# Altium project AMC_FMC_Carrier v3.PrjPcb (part 10 of 15)

## Sheet IPMI.SchDoc
size A4; DocumentNumber: 5; SheetNumber: 5; SheetTotal: 30
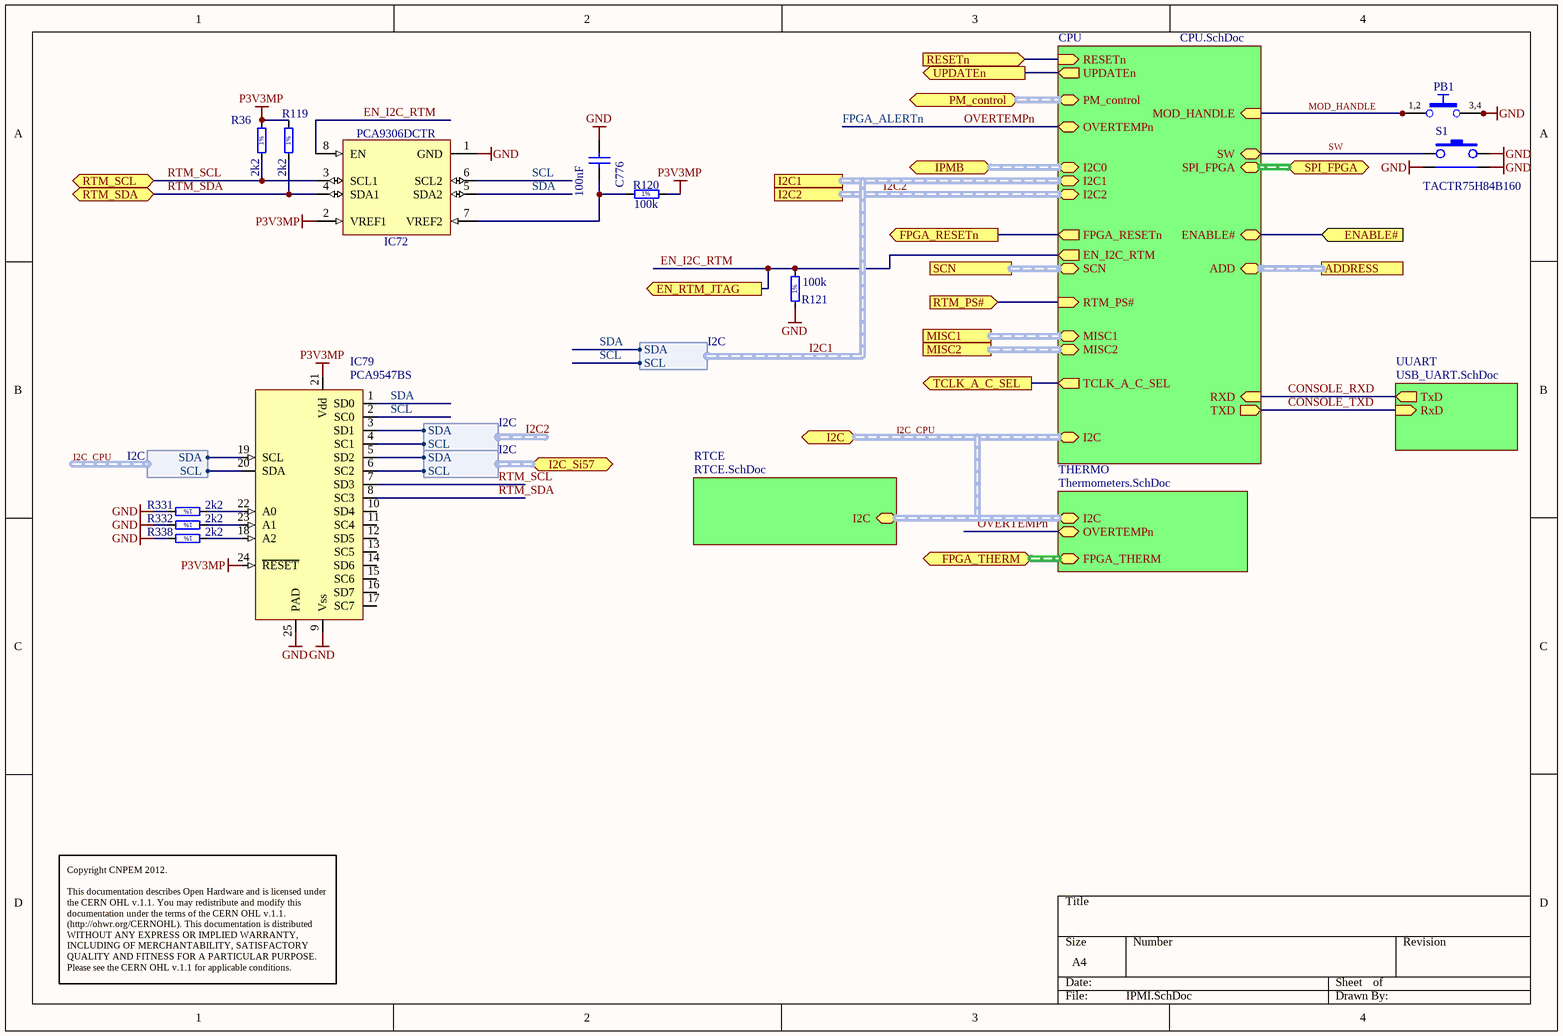
[diagram p20: IPMI.SchDoc]

### Parts
C776  100nF  [CAPC0603X33N]
IC72  PCA9306DCTR  [SOP65P400X130-8N]
IC79  PCA9547BS  [HVQFN24]
PB1  Push Button  [SW_C&K_HDT0001]  (value not drawn)
R36  2k2  [RESC1005X40N]
R119  2k2  [RESC1005X40N]
R120  100k  [RESC1005X40N]
R121  100k  [RESC1005X40N]
R331  2k2  [RESC1005X40N]
R332  2k2  [RESC1005X40N]
R338  2k2  [RESC1005X40N]
S1  TACTR75H84B160  [PB_ALPS_SKHHLQA010]

### Sub-sheets
CPU = CPU.SchDoc: ENABLE#, PM_control (harness PM_control), OVERTEMPn (bidir), MOD_HANDLE (in), SPI_FPGA (harness SPI), SW, RXD (in), TXD (out), RESETn (in), UPDATEn (out), I2C (harness I2C), I2C0 (harness I2C), I2C1 (harness I2C), I2C2 (harness I2C), MISC1 (harness MISC), MISC2 (harness MISC), ADD (harness AMC_ADD), SCN (harness SCN), FPGA_RESETn (out), RTM_PS# (in), EN_I2C_RTM (out), TCLK_A_C_SEL (out)
RTCE = RTCE.SchDoc: I2C (harness I2C)
THERMO = Thermometers.SchDoc: OVERTEMPn (bidir), FPGA_THERM (harness FPGA_THERM), I2C (harness I2C)
UUART = USB_UART.SchDoc: TxD (out), RxD (in)

### Ports
ADDRESS (harness AMC_ADD), EN_RTM_JTAG (out), ENABLE# (in), FPGA_RESETn (out), FPGA_THERM (harness FPGA_THERM), I2C1 (harness I2C), I2C2 (harness I2C), I2C (harness I2C), I2C_Si57 (harness I2C), IPMB (harness I2C), MISC1 (harness MISC), MISC2 (harness MISC), PM_control (harness PM_control), RESETn (in), RTM_PS# (in), RTM_SCL (bidir), RTM_SDA (bidir), SCN (harness SCN), SPI_FPGA (harness SPI), TCLK_A_C_SEL (out), UPDATEn (out)

### Harnesses
I2C: SCL, SDA

### Nets
GND: C776.2 IC72.1(GND) IC79.9(Vss) IC79.25(PAD) PB1.3 PB1.4 R121.1 R331.2 R332.2 R338.2 S1.2 S1.3 S1.4
P3V3MP: IC72.2(VREF1) IC79.21(Vdd) IC79.24(~{RESET}) R36.2 R119.2 R120.2
CONSOLE_RXD: sheet CPU/RXD, sheet UUART/TxD
CONSOLE_TXD: sheet CPU/TXD, sheet UUART/RxD
EN_I2C_RTM: IC72.8(EN) R121.2 ; port EN_RTM_JTAG, sheet CPU/EN_I2C_RTM
FPGA_ALERTn: sheet CPU/OVERTEMPn, sheet THERMO/OVERTEMPn  [also labelled OVERTEMPn]
FPGA_RESETn: port FPGA_RESETn, sheet CPU/FPGA_RESETn
I2C2.SCL: IC79.4(SC1) ; port I2C2.SCL
I2C2.SDA: IC79.3(SD1) ; port I2C2.SDA
I2C_CPU.SCL: IC79.20(SDA) ; port I2C.SCL
I2C_CPU.SDA: IC79.19(SCL) ; port I2C.SDA
I2C_Si57.SCL: IC79.6(SC2) ; port I2C_Si57.SCL
I2C_Si57.SDA: IC79.5(SD2) ; port I2C_Si57.SDA
MOD_HANDLE: PB1.1 PB1.2 ; sheet CPU/MOD_HANDLE
RESETn: port RESETn, sheet CPU/RESETn
RTM_PS#: port RTM_PS#, sheet CPU/RTM_PS#
RTM_SCL: IC72.3(SCL1) IC79.7(SD3) R36.1 ; port RTM_SCL
RTM_SDA: IC72.4(SDA1) IC79.8(SC3) R119.1 ; port RTM_SDA
SCL: IC72.6(SCL2) IC79.2(SC0) ; port I2C1.SCL  [project net I2C1.SCL]
SCN_ENn: port ENABLE#, sheet CPU/ENABLE#
SDA: IC72.5(SDA2) IC79.1(SD0) ; port I2C1.SDA  [project net I2C1.SDA]
SW: S1.1 ; sheet CPU/SW
TCLK_A_C_SEL: port TCLK_A_C_SEL, sheet CPU/TCLK_A_C_SEL
UPDATEn: port UPDATEn, sheet CPU/UPDATEn
NetC776_1: C776.1 IC72.7(VREF2) R120.1
NetIC79_18: IC79.18(A2) R338.1
NetIC79_22: IC79.22(A0) R331.1
NetIC79_23: IC79.23(A1) R332.1

Not connected (* = marked no-connect by the designer): IC79 10(SD4) 11(SC4) 12(SD5) 13(SC5) 14(SD6) 15(SC6) 16(SD7) 17(SC7)

### Buses and harness runs
harness I2C1 = port I2C1 = sheet CPU/I2C1
harness I2C2 = port I2C2 = sheet CPU/I2C2
harness I2C_CPU = port I2C = sheet CPU/I2C = sheet RTCE/I2C = sheet THERMO/I2C
harness port ADDRESS = sheet CPU/ADD
harness port FPGA_THERM = sheet THERMO/FPGA_THERM
harness port IPMB = sheet CPU/I2C0
harness port MISC1 = sheet CPU/MISC1
harness port MISC2 = sheet CPU/MISC2
harness port PM_control = sheet CPU/PM_control
harness port SCN = sheet CPU/SCN
harness port SPI_FPGA = sheet CPU/SPI_FPGA

### Notes on the sheet
- Copyright CNPEM 2012.
  This documentation describes Open Hardware and is licensed under the CERN OHL v.1.1. You may redistribute and modify this documentation under the terms of the CERN OHL v.1.1. (http://ohwr.org/CERNOHL). This documentation is distributed WITHOUT ANY EXPRESS OR IMPLIED WARRANTY, INCLUDING OF MERCHANTABILITY, SATISFACTORY QUALITY AND FITNESS FOR A PARTICULAR PURPOSE. Please see the CERN OHL v.1.1 for applicable conditions.
- (in symbol R0402_2K2_1%_0.0625W_100PPM) 1%
- (in symbol R0402_100K_1%_0.0625W_100PPM) 1%
- (in symbol SW_C&K_HDT0001) 1,2; 3,4

### Library data of the parts
C776 = CC0201_100NF_6.3V_10%_X5R: Non-polarised capacitor; Part Description: SMD Multilayer Chip Ceramic Capacitor; Manufacturer: GENERIC; Manufacturer1 Part Number: 02016D104KAT2A; Voltage: 6.3V; TC: X5R; Tolerance: ±10%; Table: Capacitors SMD; Part Number: CC0201_100NF_6.3V_10%_X5R; Component Kind: Standard; Component Type: Standard; Pin Count: 2; Value: 100nF; Status: Not Recommended; Manufacturer Part Number: CC0201_100NF_6.3V_10%_X5R; Case: 0201; Mounted: Yes; Socket: No; SMD: Yes; Manufacturer1 Example: AVX; Manufacturer1 ComponentHeight: 0.33mm; HelpURL: \\cern.ch\dfs\Applications\Altium\Datasheets\CC0201_X5R_AVX.pdf; Author: CERN DEM JLC; CreateDate: 2007-12-03; LatestRevisionDate: 2007-12-03
IC72 = PCA9306DCTR: Dual Bidirectional I2C Bus And SMBus Voltage-Level Translator; Manufacturer: TEXAS INSTRUMENTS; Table: Analog & Interface; Part Number: PCA9306DCTR; Component Kind: Standard; Component Type: Standard; Device: PCA9306DCTR; PackageDescription: SOP, 0.65mm, Pitch; 8 Pin, 2.80mm W X 2.95mm L X 1.30mm H Body, PC Medium Density; Part Description: Dual Bidirectional I2C Bus And SMBus Voltage-Level Translator; Manufacturer Part Number: PCA9306DCTR; Pin Count: 8; Case: SSOP8; Mounted: Yes; Socket: No; SMD: Yes; ComponentHeight: 1.3mm; Author: CERN DEM JLC; HelpURL: \\cern.ch\dfs\Applications\Altium\Datasheets\PCA9306DCTR.pdf; CreateDate: 2013-02-25; LatestRevisionDate: 2013-02-25
IC79 = IIC_MUX_PCA9547: 8-channel I2C-bus multiplexer with reset
PB1 = SW_C&K_HDT0001: Push-Button Switch SPDT; Part Description: 5VDC 1mA SPST-NO Micro Mini Surface Surface Mount Detect Push-Button Switch, HDT Serie; Manufacturer: C&K; Table: Switches; Part Number: SW_C&K_HDT0001; Component Kind: Standard; Component Type: Standard; Pin Count: 4; PackageDescription: Body 3.5x2.8mm, Micro Mini Surface Mount Detect Switches, HDT Serie; Family: Push Button; Mounted: Yes; Socket: No; SMD: Yes; Status: None; Manufacturer Part Number: HDT0001; ComponentHeight: 3.35mm; HelpURL: \\cern.ch\dfs\Applications\Altium\Datasheets\SW_C&K_HDT0001.pdf; Author: CERN DEM JLC; CreateDate: 2012-08-15; LatestRevisionDate: 2012-08-15
R36 R119 R331 R332 R338 = R0402_2K2_1%_0.0625W_100PPM: Resistor - 1%; Part Description: General Purpose Thick Film Chip Resistor; Manufacturer: GENERIC; Manufacturer1 Part Number: 232270672202L; TC: ±100ppm/°C; Table: Resistors SMD; Part Number: R0402_2K2_1%_0.0625W_100PPM; Component Kind: Standard; Component Type: Standard; Pin Count: 2; Value: 2k2; Status: Not recommended; Power: 0.0625W; Tolerance: ±1%; Manufacturer Part Number: R0402_2K2_1%_0.0625W_100PPM; Case: 0402; Mounted: Yes; Socket: No; SMD: Yes; Manufacturer1 Example: YAGEO PHYCOMP; Manufacturer1 ComponentHeight: 0.4mm; HelpURL: \\cern.ch\dfs\Applications\Altium\Datasheets\R0402_Phycomp_RC0402.pdf; Author: CERN DEM JLC; CreateDate: 2007-12-03; LatestRevisionDate: 2012-10-17
R120 R121 = R0402_100K_1%_0.0625W_100PPM: Resistor - 1%; Part Description: General Purpose Thick Film Chip Resistor; Manufacturer: GENERIC; Manufacturer1 Part Number: 232270671004L; TC: ±100ppm/°C; Table: Resistors SMD; Part Number: R0402_100K_1%_0.0625W_100PPM; Component Kind: Standard; Component Type: Standard; Pin Count: 2; Value: 100k; Status: Not recommended; Power: 0.0625W; Tolerance: ±1%; Manufacturer Part Number: R0402_100K_1%_0.0625W_100PPM; Case: 0402; Mounted: Yes; Socket: No; SMD: Yes; Manufacturer1 Example: YAGEO PHYCOMP; Manufacturer1 ComponentHeight: 0.4mm; HelpURL: \\cern.ch\dfs\Applications\Altium\Datasheets\R0402_Phycomp_RC0402.pdf; Author: CERN DEM JLC; CreateDate: 2007-12-03; LatestRevisionDate: 2012-10-17
S1 = SW-PB_RA_5.8mm: Push button

## Sheet CPU.SchDoc
size A3; DocumentNumber: 11; SheetNumber: 11; SheetTotal: 30
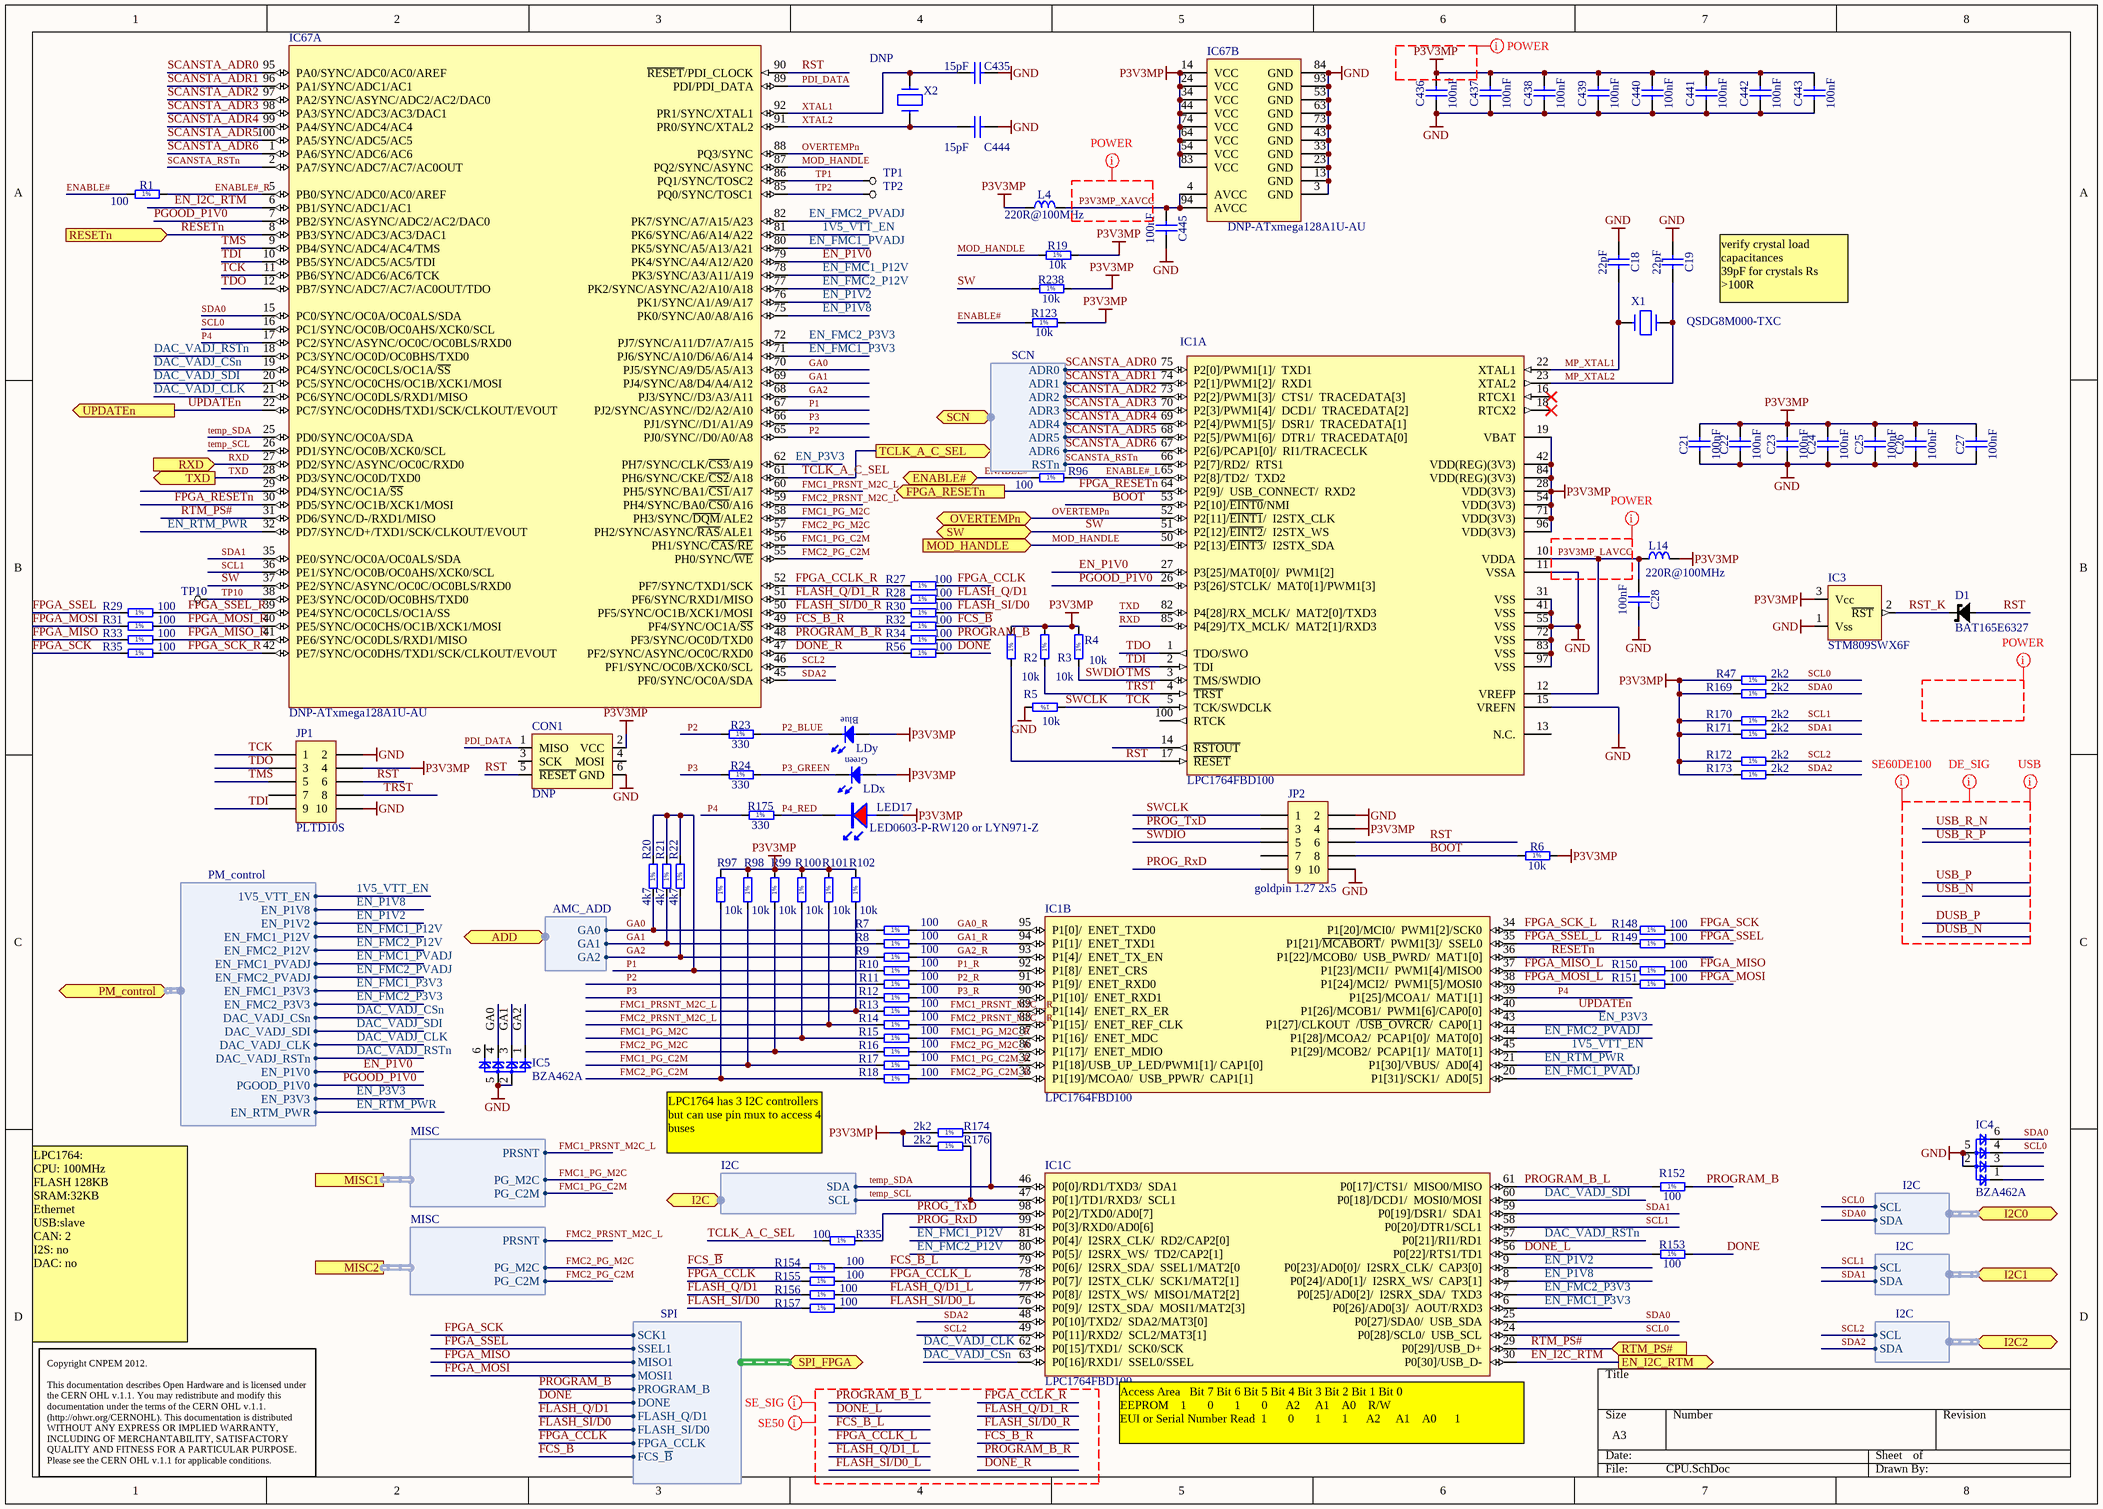
[diagram p21: CPU.SchDoc]

### Parts
C18  22pF  [CAPC1005X55N]
C19  22pF  [CAPC1005X55N]
C21  100nF  [CAPC0603X33N]
C22  100nF  [CAPC0603X33N]
C23  100nF  [CAPC0603X33N]
C24  100nF  [CAPC0603X33N]
C25  100nF  [CAPC0603X33N]
C26  100nF  [CAPC0603X33N]
C27  100nF  [CAPC0603X33N]
C28  100nF  [CAPC0603X33N]
C435  15pF  [CAPC1005X55N]
C436  100nF  [CAPC0603X33N]
C437  100nF  [CAPC0603X33N]
C438  100nF  [CAPC0603X33N]
C439  100nF  [CAPC0603X33N]
C440  100nF  [CAPC0603X33N]
C441  100nF  [CAPC0603X33N]
C442  100nF  [CAPC0603X33N]
C443  100nF  [CAPC0603X33N]
C444  15pF  [CAPC1005X55N]
C445  100nF  [CAPC0603X33N]
CON1  DNP  [PLTD6S]
D1  BAT165E6327  [SOD323]
IC1  LPC1764FBD100  [LQFP100-LPC]  (parts A,B,C of 3)
IC3  STM809SWX6F  [SOT-23]
IC4  BZA462A  [SOT23-6]
IC5  BZA462A  [SOT23-6]
IC67  DNP-ATxmega128A1U-AU  [TQFP100]  (parts A,B of 2)
JP1  PLTD10S  [PLTD10S]
JP2  goldpin 1.27 2x5  [CON_2x5_MINI]
L4  220R@100MHz  [INDC2012X105N]
L14  220R@100MHz  [INDC2012X105N]
LDx  Green  [LED_AVAGO_HSME-C120]  (value not drawn)
LDy  Blue  [LED_AVAGO_HSME-C120]  (value not drawn)
LED17  LED0603-P-RW120 or LYN971-Z  [led_0603R]
R1  100  [RESC1005X40N]
R2  10k  [RESC1005X40N]
R3  10k  [RESC1005X40N]
R4  10k  [RESC1005X40N]
R5  10k  [RESC1005X40N]
R6  10k  [RESC1005X40N]
R7  100  [RESC1005X40N]
R8  100  [RESC1005X40N]
R9  100  [RESC1005X40N]
R10  100  [RESC1005X40N]
R11  100  [RESC1005X40N]
R12  100  [RESC1005X40N]
R13  100  [RESC1005X40N]
R14  100  [RESC1005X40N]
R15  100  [RESC1005X40N]
R16  100  [RESC1005X40N]
R17  100  [RESC1005X40N]
R18  100  [RESC1005X40N]
R19  10k  [RESC1005X40N]
R20  4k7  [RESC1005X40N]
R21  4k7  [RESC1005X40N]
R22  4k7  [RESC1005X40N]
R23  330  [RESC1005X40N]
R24  330  [RESC1005X40N]
R27  100  [RESC1005X40N]
R28  100  [RESC1005X40N]
R29  100  [RESC1005X40N]
R30  100  [RESC1005X40N]
R31  100  [RESC1005X40N]
R32  100  [RESC1005X40N]
R33  100  [RESC1005X40N]
R34  100  [RESC1005X40N]
R35  100  [RESC1005X40N]
R47  2k2  [RESC1005X40N]
R56  100  [RESC1005X40N]
R96  100  [RESC1005X40N]
R97  10k  [RESC1005X40N]
R98  10k  [RESC1005X40N]
R99  10k  [RESC1005X40N]
R100  10k  [RESC1005X40N]
R101  10k  [RESC1005X40N]
R102  10k  [RESC1005X40N]
R123  10k  [RESC1005X40N]
R148  100  [RESC1005X40N]
R149  100  [RESC1005X40N]
R150  100  [RESC1005X40N]
R151  100  [RESC1005X40N]
R152  100  [RESC1005X40N]
R153  100  [RESC1005X40N]
R154  100  [RESC1005X40N]
R155  100  [RESC1005X40N]
R156  100  [RESC1005X40N]
R157  100  [RESC1005X40N]
R169  2k2  [RESC1005X40N]
R170  2k2  [RESC1005X40N]
R171  2k2  [RESC1005X40N]
R172  2k2  [RESC1005X40N]
R173  2k2  [RESC1005X40N]
R174  2k2  [RESC1005X40N]
R175  330  [RESC1005X40N]
R176  2k2  [RESC1005X40N]
R238  10k  [RESC1005X40N]
R335  100  [RESC1005X40N]
TP1  TP  [TP]  (value not drawn)
TP2  TP  [TP]  (value not drawn)
TP10  TP  [TP]  (value not drawn)
X1  QSDG8M000-TXC  [XTAL_5.0*3.2]
X2  DNP  [XTAL_5.0*3.2]

### Ports
ADD (harness AMC_ADD), EN_I2C_RTM (out), ENABLE#, FPGA_RESETn (out), I2C0 (harness I2C), I2C1 (harness I2C), I2C2 (harness I2C), I2C (harness I2C), MISC1 (harness MISC), MISC2 (harness MISC), MOD_HANDLE (in), OVERTEMPn (bidir), PM_control (harness PM_control), RESETn (in), RTM_PS# (in), RXD (in), SCN (harness SCN), SPI_FPGA (harness SPI), SW, TCLK_A_C_SEL (out), TXD (out), UPDATEn (out)

### Harnesses
SPI: SCK1, SSEL1, MISO1, MOSI1, FLASH_Q/D1, FLASH_SI/D0, PROGRAM_B, DONE, FPGA_CCLK, FCS_~{B}
PM_control: EN_P1V8, EN_P1V2, EN_FMC1_P12V, EN_FMC2_P12V, EN_FMC1_PVADJ, EN_FMC2_PVADJ, EN_FMC1_P3V3, EN_FMC2_P3V3, DAC_VADJ_CSn, DAC_VADJ_SDI, DAC_VADJ_CLK, DAC_VADJ_RSTn, 1V5_VTT_EN, EN_P1V0, PGOOD_P1V0, EN_P3V3, EN_RTM_PWR
I2C: SCL, SDA
MISC: PRSNT, PG_M2C, PG_C2M
AMC_ADD: GA0, GA1, GA2
SCN: ADR0, ADR1, ADR2, ADR3, ADR4, ADR5, ADR6, RSTn

### Nets
GND: C18.1 C19.1 C21.1 C22.1 C23.1 C24.1 C25.1 C26.1 C27.1 C28.2 C435.1 C436.1 C437.1 C438.1 C439.1 C440.1 C441.1 C442.1 C443.1 C444.1 C445.2 CON1.6(GND) IC1.11(VSSA) IC1.15(VREFN) IC1.31(VSS) IC1.41(VSS) IC1.55(VSS) IC1.72(VSS) IC1.83(VSS) IC1.97(VSS) IC3.1(Vss) IC4.2 IC4.5 IC5.2 IC5.5 IC67.3(GND) IC67.13(GND) IC67.23(GND) IC67.33(GND) IC67.43(GND) IC67.53(GND) IC67.63(GND) IC67.73(GND) IC67.84(GND) IC67.93(GND) JP1.2 JP1.10 JP2.2 JP2.10 R5.2
P3V3MP: C21.2 C22.2 C23.2 C24.2 C25.2 C26.2 C27.2 C436.2 C437.2 C438.2 C439.2 C440.2 C441.2 C442.2 C443.2 CON1.2(VCC) IC1.19(VBAT) IC1.28(VDD(3V3)) IC1.42(VDD(REG)(3V3)) IC1.54(VDD(3V3)) IC1.71(VDD(3V3)) IC1.84(VDD(REG)(3V3)) IC1.96(VDD(3V3)) IC3.3(Vcc) IC67.14(VCC) IC67.24(VCC) IC67.34(VCC) IC67.44(VCC) IC67.54(VCC) IC67.64(VCC) IC67.74(VCC) IC67.83(VCC) JP1.4 JP2.4 L4.1 L14.2 LDx.1(A) LDy.1(A) LED17.A R2.2 R3.2 R4.2 R6.2 R19.2 R47.1 R97.2 R98.2 R99.2 R100.2 R101.2 R102.2 R123.2 R169.1 R170.1 R171.1 R172.1 R173.1 R174.1 R176.1 R238.2
1V5_VTT_EN: IC1.45(P1[29]/MCOB2/__PCAP1[1]/__MAT0[1]) IC67.81(PK6/SYNC/A6/A14/A22) ; port PM_control.1V5_VTT_EN  [project net PM.1V5_VTT_EN]
BOOT: IC1.53(P2[10]/~{EINT0}/NMI) JP2.8 R6.1
DAC_VADJ_CLK: IC1.62(P0[15]/TXD1/__SCK0/SCK) IC67.21(PC6/SYNC/OC0DLS/RXD1/MISO) ; port PM_control.DAC_VADJ_CLK  [project net PM.DAC_VADJ_CLK]
DAC_VADJ_CSn: IC1.63(P0[16]/RXD1/__SSEL0/SSEL) IC67.19(PC4/SYNC/OC0CLS/OC1A/~{SS}) ; port PM_control.DAC_VADJ_CSn  [project net PM.DAC_VADJ_CSn]
DAC_VADJ_RSTn: IC1.57(P0[21]/RI1/RD1) IC67.18(PC3/SYNC/OC0D/OC0BHS/TXD0) ; port PM_control.DAC_VADJ_RSTn  [project net PM.DAC_VADJ_RSTn]
DAC_VADJ_SDI: IC1.60(P0[18]/DCD1/__MOSI0/MOSI) IC67.20(PC5/SYNC/OC0CHS/OC1B/XCK1/MOSI) ; port PM_control.DAC_VADJ_SDI  [project net PM.DAC_VADJ_SDI]
DONE: R56.2 R153.2 ; port SPI_FPGA.DONE  [project net FSPI.DONE]
DONE_L: IC1.56(P0[22]/RTS1/TD1) R153.1
DONE_R: IC67.47(PF2/SYNC/ASYNC/OC0C/RXD0) R56.1
EN_FMC1_P3V3: IC1.6(P0[26]/AD0[3]/__AOUT/RXD3) IC67.71(PJ6/SYNC/A10/D6/A6/A14) ; port PM_control.EN_FMC1_P3V3  [project net PM.EN_FMC1_P3V3]
EN_FMC1_P12V: IC1.81(P0[4]/__I2SRX_CLK/__RD2/CAP2[0]) IC67.78(PK3/SYNC/A3/A11/A19) ; port PM_control.EN_FMC1_P12V  [project net PM.EN_FMC1_P12V]
EN_FMC1_PVADJ: IC1.20(P1[31]/SCK1/__AD0[5]) IC67.80(PK5/SYNC/A5/A13/A21) ; port PM_control.EN_FMC1_PVADJ  [project net PM.EN_FMC1_PVADJ]
EN_FMC2_P3V3: IC1.7(P0[25]/AD0[2]/__I2SRX_SDA/__TXD3) IC67.72(PJ7/SYNC/A11/D7/A7/A15) ; port PM_control.EN_FMC2_P3V3  [project net PM.EN_FMC2_P3V3]
EN_FMC2_P12V: IC1.80(P0[5]/__I2SRX_WS/__TD2/CAP2[1]) IC67.77(PK2/SYNC/ASYNC/A2/A10/A18) ; port PM_control.EN_FMC2_P12V  [project net PM.EN_FMC2_P12V]
EN_FMC2_PVADJ: IC1.44(P1[28]/MCOA2/__PCAP1[0]/__MAT0[0]) IC67.82(PK7/SYNC/A7/A15/A23) ; port PM_control.EN_FMC2_PVADJ  [project net PM.EN_FMC2_PVADJ]
EN_I2C_RTM: IC1.30(P0[30]/USB_D-) IC67.6(PB1/SYNC/ADC1/AC1) ; port EN_I2C_RTM
EN_P1V0: IC1.27(P3[25]/MAT0[0]/__PWM1[2]) IC67.79(PK4/SYNC/A4/A12/A20) ; port PM_control.EN_P1V0  [project net PM.EN_P1V0]
EN_P1V2: IC1.9(P0[23]/AD0[0]/__I2SRX_CLK/__CAP3[0]) IC67.76(PK1/SYNC/A1/A9/A17) ; port PM_control.EN_P1V2  [project net PM.EN_P1V2]
EN_P1V8: IC1.8(P0[24]/AD0[1]/__I2SRX_WS/__CAP3[1]) IC67.75(PK0/SYNC/A0/A8/A16) ; port PM_control.EN_P1V8  [project net PM.EN_P1V8]
EN_P3V3: IC1.43(P1[27]/CLKOUT__/~{USB_OVRCR}/__CAP0[1]) IC67.62(PH7/SYNC/CLK/~{CS3}/A19) ; port PM_control.EN_P3V3  [project net PM.EN_P3V3]
EN_RTM_PWR: IC1.21(P1[30]/VBUS/__AD0[4]) IC67.32(PD7/SYNC/D+/TXD1/SCK/CLKOUT/EVOUT) ; port PM_control.EN_RTM_PWR  [project net PM.EN_RTM_PWR]
ENABLE#: R1.1 R96.1 R123.1 ; port ENABLE#  [project net SCN_ENn]
ENABLE#_L: IC1.65(P2[8]/TD2/__TXD2) R96.2
ENABLE#_R: IC67.5(PB0/SYNC/ADC0/AC0/AREF) R1.2
FCS_~{B}: R32.2 R154.1 ; port SPI_FPGA.FCS_~{B}  [project net FSPI.FCS_~{B}]
FCS_~{B}_L: IC1.79(P0[6]/__I2SRX_SDA/__SSEL1/MAT2[0) R154.2
FCS_~{B}_R: IC67.49(PF4/SYNC/OC1A/~{SS}) R32.1
FLASH_Q/D1: R28.2 R156.1 ; port SPI_FPGA.FLASH_Q/D1  [project net FSPI.FLASH_Q/D1]
FLASH_Q/D1_L: IC1.77(P0[8]/__I2STX_WS/__MISO1/MAT2[2]) R156.2
FLASH_Q/D1_R: IC67.51(PF6/SYNC/RXD1/MISO) R28.1
FLASH_SI/D0: R30.2 R157.1 ; port SPI_FPGA.FLASH_SI/D0  [project net FSPI.FLASH_SI/D0]
FLASH_SI/D0_L: IC1.76(P0[9]/__I2STX_SDA/__MOSI1/MAT2[3]) R157.2
FLASH_SI/D0_R: IC67.50(PF5/SYNC/OC1B/XCK1/MOSI) R30.1
FMC1_PG_C2M: IC67.56(PH1/SYNC/~{CAS}/~{RE}) R17.1 R98.1 ; port MISC1.PG_C2M  [project net MISC1.PG_C2M]
FMC1_PG_C2M_R: IC1.32(P1[18]/USB_UP_LED/PWM1[1]/_CAP1[0]) R17.2
FMC1_PG_M2C: IC67.58(PH3/SYNC/~{DQM}/ALE2) R15.1 R100.1 ; port MISC1.PG_M2C  [project net MISC1.PG_M2C]
FMC1_PG_M2C_R: IC1.87(P1[16]/__ENET_MDC) R15.2
FMC1_PRSNT_M2C__R: IC1.89(P1[14]/__ENET_RX_ER) R13.2
FMC1_PRSNT_M2C_L: IC67.60(PH5/SYNC/BA1/~{CS1}/A17) R13.1 R102.1 ; port MISC1.PRSNT  [project net MISC1.PRSNT]
FMC2_PG_C2M: IC67.55(PH0/SYNC/~{WE}) R18.1 R97.1 ; port MISC2.PG_C2M  [project net MISC2.PG_C2M]
FMC2_PG_C2M_R: IC1.33(P1[19]/MCOA0/__USB_PPWR/__CAP1[1]) R18.2
FMC2_PG_M2C: IC67.57(PH2/SYNC/ASYNC/~{RAS}/ALE1) R16.1 R99.1 ; port MISC2.PG_M2C  [project net MISC2.PG_M2C]
FMC2_PG_M2C_R: IC1.86(P1[17]/__ENET_MDIO) R16.2
FMC2_PRSNT_M2C__R: IC1.88(P1[15]/__ENET_REF_CLK) R14.2
FMC2_PRSNT_M2C_L: IC67.59(PH4/SYNC/BA0/~{CS0}/A16) R14.1 R101.1 ; port MISC2.PRSNT  [project net MISC2.PRSNT]
FPGA_CCLK: R27.2 R155.1 ; port SPI_FPGA.FPGA_CCLK  [project net FSPI.FPGA_CCLK]
FPGA_CCLK_L: IC1.78(P0[7]/__I2STX_CLK/__SCK1/MAT2[1]) R155.2
FPGA_CCLK_R: IC67.52(PF7/SYNC/TXD1/SCK) R27.1
FPGA_MISO: R33.1 R150.2 ; port SPI_FPGA.MISO1  [project net FSPI.MISO1]
FPGA_MISO_L: IC1.37(P1[23]/MCI1/__PWM1[4]/MISO0) R150.1
FPGA_MISO_R: IC67.41(PE6/SYNC/OC0DLS/RXD1/MISO) R33.2
FPGA_MOSI: R31.1 R151.2 ; port SPI_FPGA.MOSI1  [project net FSPI.MOSI1]
FPGA_MOSI_L: IC1.38(P1[24]/MCI2/__PWM1[5]/MOSI0) R151.1
FPGA_MOSI_R: IC67.40(PE5/SYNC/OC0CHS/OC1B/XCK1/MOSI) R31.2
FPGA_RESETn: IC1.64(P2[9]/__USB_CONNECT/__RXD2) IC67.30(PD5/SYNC/OC1B/XCK1/MOSI) ; port FPGA_RESETn
FPGA_SCK: R35.1 R148.2 ; port SPI_FPGA.SCK1  [project net FSPI.SCK1]
FPGA_SCK_L: IC1.34(P1[20]/MCI0/__PWM1[2]/SCK0) R148.1
FPGA_SCK_R: IC67.42(PE7/SYNC/OC0DHS/TXD1/SCK/CLKOUT/EVOUT) R35.2
FPGA_SSEL: R29.1 R149.2 ; port SPI_FPGA.SSEL1  [project net FSPI.SSEL1]
FPGA_SSEL_L: IC1.35(P1[21]/~{MCABORT}/__PWM1[3]/__SSEL0) R149.1
FPGA_SSEL_R: IC67.39(PE4/SYNC/OC0CLS/OC1A/SS) R29.2
GA0: IC5.4 IC67.70(PJ5/SYNC/A9/D5/A5/A13) R7.1 R20.1 ; port ADD.GA0  [project net ADD.GA0]
GA0_R: IC1.95(P1[0]/__ENET_TXD0) R7.2
GA1: IC5.3 IC67.69(PJ4/SYNC/A8/D4/A4/A12) R8.1 R21.1 ; port ADD.GA1  [project net ADD.GA1]
GA1_R: IC1.94(P1[1]/__ENET_TXD1) R8.2
GA2: IC5.1 IC67.68(PJ3/SYNC//D3/A3/A11) R9.1 R22.1 ; port ADD.GA2  [project net ADD.GA2]
GA2_R: IC1.93(P1[4]/__ENET_TX_EN) R9.2
MOD_HANDLE: IC1.50(P2[13]/~{EINT3}/__I2STX_SDA) IC67.87(PQ2/SYNC/ASYNC) R19.1 ; port MOD_HANDLE
MP_XTAL1: C18.2 IC1.22(XTAL1) X1.1
MP_XTAL2: C19.2 IC1.23(XTAL2) X1.2
OVERTEMPn: IC1.52(P2[11]/~{EINT1}/__I2STX_CLK) IC67.88(PQ3/SYNC) ; port OVERTEMPn  [project net FPGA_ALERTn]
P1: IC67.67(PJ2/SYNC/ASYNC//D2/A2/A10) R10.1 R20.2 R21.2 R22.2
P1_R: IC1.92(P1[8]/__ENET_CRS) R10.2
P2: IC67.65(PJ0/SYNC//D0/A0/A8) R11.1 R23.1
P2_BLUE: LDy.2(C) R23.2
P2_R: IC1.91(P1[9]/__ENET_RXD0) R11.2
P3: IC67.66(PJ1/SYNC//D1/A1/A9) R12.1 R24.1
P3_GREEN: LDx.2(C) R24.2
P3_R: IC1.90(P1[10]/__ENET_RXD1) R12.2
P3V3MP_LAVCC: C28.1 IC1.10(VDDA) IC1.12(VREFP) L14.1
P3V3MP_XAVCC: C445.1 IC67.4(AVCC) IC67.94(AVCC) L4.2
P4: IC1.39(P1[25]/MCOA1/__MAT1[1]) IC67.17(PC2/SYNC/ASYNC/OC0C/OC0BLS/RXD0) R175.1
P4_RED: LED17.K R175.2
PDI_DATA: CON1.1(MISO) IC67.89(PDI/PDI_DATA)
PGOOD_P1V0: IC1.26(P3[26]/STCLK/__MAT0[1]/PWM1[3]) IC67.7(PB2/SYNC/ASYNC/ADC2/AC2/DAC0) ; port PM_control.PGOOD_P1V0  [project net PM.PGOOD_P1V0]
PROG_RxD: IC1.99(P0[3]/RXD0/AD0[6]) JP2.9
PROG_TxD: IC1.98(P0[2]/TXD0/AD0[7]) JP2.3 R335.2
PROGRAM_B: R34.2 R152.2 ; port SPI_FPGA.PROGRAM_B  [project net FSPI.PROGRAM_B]
PROGRAM_B_L: IC1.61(P0[17]/CTS1/__MISO0/MISO) R152.1
PROGRAM_B_R: IC67.48(PF3/SYNC/OC0D/TXD0) R34.1
RESETn: IC1.36(P1[22]/MCOB0/__USB_PWRD/__MAT1[0]) IC67.8(PB3/SYNC/ADC3/AC3/DAC1) ; port RESETn
RST: CON1.5(~{RESET}) D1.A IC1.17(~{RESET}) IC67.90(~{RESET}/PDI_CLOCK) JP1.6 JP2.6 R2.1
RST_K: D1.K IC3.2(~{RST})
RTM_PS#: IC1.29(P0[29]/USB_D+) IC67.31(PD6/SYNC/D-/RXD1/MISO) ; port RTM_PS#
RXD: IC1.85(P4[29]/TX_MCLK/__MAT2[1]/RXD3) IC67.27(PD2/SYNC/ASYNC/OC0C/RXD0) ; port RXD  [project net CONSOLE_RXD]
SCANSTA_ADR0: IC1.75(P2[0]/PWM1[1]/__TXD1) IC67.95(PA0/SYNC/ADC0/AC0/AREF) ; port SCN.ADR0  [project net SCN.ADR0]
SCANSTA_ADR1: IC1.74(P2[1]/PWM1[2]/__RXD1) IC67.96(PA1/SYNC/ADC1/AC1) ; port SCN.ADR1  [project net SCN.ADR1]
SCANSTA_ADR2: IC1.73(P2[2]/PWM1[3]/__CTS1/__TRACEDATA[3]) IC67.97(PA2/SYNC/ASYNC/ADC2/AC2/DAC0) ; port SCN.ADR2  [project net SCN.ADR2]
SCANSTA_ADR3: IC1.70(P2[3]/PWM1[4]/__DCD1/__TRACEDATA[2]) IC67.98(PA3/SYNC/ADC3/AC3/DAC1) ; port SCN.ADR3  [project net SCN.ADR3]
SCANSTA_ADR4: IC1.69(P2[4]/PWM1[5]/__DSR1/__TRACEDATA[1]) IC67.99(PA4/SYNC/ADC4/AC4) ; port SCN.ADR4  [project net SCN.ADR4]
SCANSTA_ADR5: IC1.68(P2[5]/PWM1[6]/__DTR1/__TRACEDATA[0]) IC67.100(PA5/SYNC/ADC5/AC5) ; port SCN.ADR5  [project net SCN.ADR5]
SCANSTA_ADR6: IC1.67(P2[6]/PCAP1[0]/__RI1/TRACECLK) IC67.1(PA6/SYNC/ADC6/AC6) ; port SCN.ADR6  [project net SCN.ADR6]
SCANSTA_RSTn: IC1.66(P2[7]/RD2/__RTS1) IC67.2(PA7/SYNC/ADC7/AC7/AC0OUT) ; port SCN.RSTn  [project net SCN.RSTn]
SCL0: IC1.24(P0[28]/SCL0/__USB_SCL) IC4.4 IC67.16(PC1/SYNC/OC0B/OC0AHS/XCK0/SCL) R47.2 ; port I2C0.SCL  [project net IPMB.SCL]
SCL1: IC1.58(P0[20]/DTR1/SCL1) IC67.36(PE1/SYNC/OC0B/OC0AHS/XCK0/SCL) R170.2 ; port I2C1.SCL  [project net I2C1.SCL]
SCL2: IC1.49(P0[11]/RXD2/__SCL2/MAT3[1]) IC67.46(PF1/SYNC/OC0B/XCK0/SCL) R172.2 ; port I2C2.SCL  [project net I2C2.SCL]
SDA0: IC1.25(P0[27]/SDA0/__USB_SDA) IC4.6 IC67.15(PC0/SYNC/OC0A/OC0ALS/SDA) R169.2 ; port I2C0.SDA  [project net IPMB.SDA]
SDA1: IC1.59(P0[19]/DSR1/__SDA1) IC67.35(PE0/SYNC/OC0A/OC0ALS/SDA) R171.2 ; port I2C1.SDA  [project net I2C1.SDA]
SDA2: IC1.48(P0[10]/TXD2/__SDA2/MAT3[0]) IC67.45(PF0/SYNC/OC0A/SDA) R173.2 ; port I2C2.SDA  [project net I2C2.SDA]
SW: IC1.51(P2[12]/~{EINT2}/__I2STX_WS) IC67.37(PE2/SYNC/ASYNC/OC0C/OC0BLS/RXD0) R238.1 ; port SW
SWCLK: IC1.5(TCK/SWDCLK) IC67.11(PB6/SYNC/ADC6/AC6/TCK) JP1.1 JP2.1 R5.1  [also labelled TCK]
SWDIO: IC1.3(TMS/SWDIO) IC67.9(PB4/SYNC/ADC4/AC4/TMS) JP1.5 JP2.5 R4.1  [also labelled TMS]
TCLK_A_C_SEL: IC67.61(PH6/SYNC/CKE/~{CS2}/A18) R335.1 ; port TCLK_A_C_SEL
TDI: IC1.2(TDI) IC67.10(PB5/SYNC/ADC5/AC5/TDI) JP1.9
TDO: IC1.1(TDO/SWO) IC67.12(PB7/SYNC/ADC7/AC7/AC0OUT/TDO) JP1.3
temp_SCL: IC1.47(P0[1]/TD1/RXD3/__SCL1) IC67.26(PD1/SYNC/OC0B/XCK0/SCL) R176.2 ; port I2C.SCL  [project net I2C_CPU.SCL]
temp_SDA: IC1.46(P0[0]/RD1/TXD3/__SDA1) IC67.25(PD0/SYNC/OC0A/SDA) R174.2 ; port I2C.SDA  [project net I2C_CPU.SDA]
TP1: IC67.86(PQ1/SYNC/TOSC2) TP1.1
TP2: IC67.85(PQ0/SYNC/TOSC1) TP2.1
TP10: IC67.38(PE3/SYNC/OC0D/OC0BHS/TXD0) TP10.1
TRST: IC1.4(~{TRST}) JP1.8 R3.1
TXD: IC1.82(P4[28]/RX_MCLK/__MAT2[0]/TXD3) IC67.28(PD3/SYNC/OC0D/TXD0) ; port TXD  [project net CONSOLE_TXD]
UPDATEn: IC1.40(P1[26]/MCOB1/__PWM1[6]/CAP0[0]) IC67.22(PC7/SYNC/OC0DHS/TXD1/SCK/CLKOUT/EVOUT) ; port UPDATEn
XTAL1: C435.2 IC67.92(PR1/SYNC/XTAL1) X2.1
XTAL2: C444.2 IC67.91(PR0/SYNC/XTAL2) X2.2

Not connected (* = marked no-connect by the designer): CON1 3(SCK) 4(MOSI); IC1 13(N.C.) 14(~{RSTOUT}) 16(RTCX1)* 18(RTCX2)* 100(RTCK); IC4 1 3; IC5 6; IC67 29(PD4/SYNC/OC1A/~{SS}); JP1 7; JP2 7

### Layout directives
net class POWER: (no net found under the mark), P3V3MP, P3V3MP_LAVCC, P3V3MP_XAVCC
net class SE_SIG: DONE_L, DONE_R, FCS_~{B}_L, FCS_~{B}_R, FLASH_Q/D1_L, FLASH_Q/D1_R, FLASH_SI/D0_L, FLASH_SI/D0_R, FPGA_CCLK_L, FPGA_CCLK_R, PROGRAM_B_L, PROGRAM_B_R
net class SE50: DONE_L, DONE_R, FCS_~{B}_L, FCS_~{B}_R, FLASH_Q/D1_L, FLASH_Q/D1_R, FLASH_SI/D0_L, FLASH_SI/D0_R, FPGA_CCLK_L, FPGA_CCLK_R, PROGRAM_B_L, PROGRAM_B_R
net class SE60DE100: DUSB_N, DUSB_P, USB_N, USB_P, USB_R_N, USB_R_P
net class DE_SIG: DUSB_N, DUSB_P, USB_N, USB_P, USB_R_N, USB_R_P
net class USB: DUSB_N, DUSB_P, USB_N, USB_P, USB_R_N, USB_R_P

### Notes on the sheet
- verify crystal load capacitances
  39pF for crystals Rs >100R
- LPC1764 has 3 I2C controllers but can use pin mux to access 4 buses
- LPC1764:
  CPU: 100MHz
  FLASH 128KB
  SRAM:32KB
  Ethernet
  USB:slave
  CAN: 2
  I2S: no
  DAC: no
- (near IC1) Access Area 		Bit 7 Bit 6 Bit 5 Bit 4 Bit 3 Bit 2 Bit 1 Bit 0
  EEPROM 			1       0       1       0      A2     A1    A0    R/W
  EUI or Serial Number Read 	1       0       1       1      A2     A1    A0      1
- Copyright CNPEM 2012.
  This documentation describes Open Hardware and is licensed under the CERN OHL v.1.1. You may redistribute and modify this documentation under the terms of the CERN OHL v.1.1. (http://ohwr.org/CERNOHL). This documentation is distributed WITHOUT ANY EXPRESS OR IMPLIED WARRANTY, INCLUDING OF MERCHANTABILITY, SATISFACTORY QUALITY AND FITNESS FOR A PARTICULAR PURPOSE. Please see the CERN OHL v.1.1 for applicable conditions.
- (in symbol R0402_2K2_1%_0.0625W_100PPM) 1%
- (in symbol R0402_4K7_1%_0.0625W_100PPM) 1%
- (in symbol R0402_10K_1%_0.0625W_100PPM) 1%
- (in symbol R0402_100R_1%_0.0625W_100PPM) 1%
- (in symbol R0402_330R_1%_0.0625W_100PPM) 1%
- (in symbol LED_AVAGO_HSME-C120) Green

### Library data of the parts
C18 C19 = CC0402_22PF_50V_5%_NP0: Non-polarised capacitor; Part Description: SMD Multilayer Chip Ceramic Capacitor; Manufacturer: GENERIC; Manufacturer1 Part Number: 223886915229; Voltage: 50V; TC: NP0; Tolerance: ±5%; Table: Capacitors SMD; Part Number: CC0402_22PF_50V_5%_NP0; Component Kind: Standard; Component Type: Standard; Pin Count: 2; Value: 22pF; Status: Not Recommended; Manufacturer Part Number: CC0402_22PF_50V_5%_NP0; Case: 0402; Mounted: Yes; Socket: No; SMD: Yes; Manufacturer1 Example: PHYCOMP; Manufacturer1 ComponentHeight: 0.55mm; HelpURL: \\cern.ch\dfs\Applications\Altium\Datasheets\CC0402_NP0_PHYCOMP.pdf; Author: CERN DEM JLC; CreateDate: 2007-12-03; LatestRevisionDate: 2007-12-03
C21-C28 C436-C443 C445 = CC0201_100NF_6.3V_10%_X5R: as C776 on sheet IPMI; Part Number: CC0201_100NF_6.3V_10%_X5R; Component Kind: Standard; Component Type: Standard; Pin Count: 2; Value: 100nF; Status: Not Recommended; Manufacturer Part Number: CC0201_100NF_6.3V_10%_X5R; Case: 0201; Mounted: Yes; Socket: No; SMD: Yes; Manufacturer1 Example: AVX; Manufacturer1 ComponentHeight: 0.33mm; HelpURL: \\cern.ch\dfs\Applications\Altium\Datasheets\CC0201_X5R_AVX.pdf; Author: CERN DEM JLC; CreateDate: 2007-12-03; LatestRevisionDate: 2007-12-03
C435 C444 = CC0402_15PF_50V_5%_NP0: Non-polarised capacitor; Part Description: SMD Multilayer Chip Ceramic Capacitor; Manufacturer: GENERIC; Manufacturer1 Part Number: 223886915159; Voltage: 50V; TC: NP0; Tolerance: ±5%; Table: Capacitors SMD; Part Number: CC0402_15PF_50V_5%_NP0; Component Kind: Standard; Component Type: Standard; Pin Count: 2; Value: 15pF; Status: Not Recommended; Manufacturer Part Number: CC0402_15PF_50V_5%_NP0; Case: 0402; Mounted: Yes; Socket: No; SMD: Yes; Manufacturer1 Example: PHYCOMP; Manufacturer1 ComponentHeight: 0.55mm; HelpURL: \\cern.ch\dfs\Applications\Altium\Datasheets\CC0402_NP0_PHYCOMP.pdf; Author: CERN DEM JLC; CreateDate: 2007-12-03; LatestRevisionDate: 2007-12-03
CON1 = CON_ISP: 6x 2.54mm SMT  dual row pin header
D1 = D_BAT165: 500mA, 40V, Shottky Diode
IC1 = UPC_LPC1764: ARM Cortex-M3 procesor
IC3 = VMON_STM809: 2.93V  Reset circuit
IC4 IC5 = D_TVS_BZA462A: Quadruple 4V ESD transient voltage suppressor; Supplier 1: Newark; Supplier Part Number 1: 79R1868
IC67 = UPC_ATxmega128A1-AU: 8/16-bit AVR XMEGA A1 Microcontroller, 1.6-3.6V, 128KB + 8KB Flash, 2KB EEPROM, 8KB SRAM, 100-pin TQFP, Industrial Grade (-40°C to 85°C), Pb-Free; Published: 1-Apr-2010; DatasheetVersion: revK, Feb-2010; PackageVersion: revC, Oct-2001; PackageReference: 100A; Publisher: Altium Limited; PackageDescription: 100-Pin Thin Profile Plastic Quad Flat Pack (TQFP), 14 x 14 x 1.0 mm Body, 0.5 mm Pitch; Supplier 1: Digi-Key; Supplier Part Number 1: ATXMEGA128A1-AU-ND; Supplier 2: Farnell; Supplier Part Number 2: 1704571; Supplier 3: Mouser; Supplier Part Number 3: 556-ATXMEGA128A1-AU; Code_JEDEC: MS-026-AED; ComponentLink1Description: Manufacturer Link; ComponentLink1URL: http://www.atmel.com/products/avr/default.asp?; ComponentLink2Description: ATxmega64A1/128A1/192A1/256A1/384A1 Datasheet; ComponentLink2URL: http://www.atmel.com/dyn/resources/prod_documents/doc8067.pdf; ComponentLink3Description: Atmel.com Home; ComponentLink3URL: http://www.atmel.com
JP1 = CON_2x5 2.54 male SMT: Goldpin 2.54mm, male header
JP2 = CON_HEADER 5X2: PBTD10S
L4 L14 = IND0805_MURATA_BLM21PG221SN1D: Inductor; Part Description: SMD EMIFIL Suppression Chip Ferrite Bead; Manufacturer: MURATA; Power: 2A; Resistance: 0.05R; Tolerance: ±25%; Table: Inductors SMD; Part Number: IND0805_MURATA_BLM21PG221SN1D; Component Kind: Standard; Component Type: Standard; Pin Count: 2; Value: 220R@100MHz; Status: None; Manufacturer Part Number: BLM21PG221SN1D; Case: 0805; Mounted: Yes; Socket: No; SMD: Yes; ComponentHeight: 1.05mm; HelpURL: \\cern.ch\dfs\Applications\Altium\Datasheets\IND0402_MURATA_BLM21P.pdf; Author: CERN DEM JLC; CreateDate: 2010-01-25; LatestRevisionDate: 2010-01-25
LDx = LED_SMD_90deg_mini_G: LED Green Avago C120; Part Description: High Performance Right Angle Chip Green LED; Manufacturer: AVAGO TECHNOLOGIES; Manufacturer Part Number: HSME-C120; Table: LEDs & Displays; Part Number: LED_AVAGO_HSME-C120; Component Kind: Standard; Component Type: Standard; Color: Green; PackageDescription: Green Chip LED, 2-Leads, Body 1.7x1.1mm, Side Emitting Package; Pin Count: 2; Mounted: Yes; Socket: No; SMD: Yes; ComponentHeight: 0.7mm; HelpURL: \\cern.ch\dfs\Applications\Altium\Datasheets\LED_AVAGO_HSME-C120.pdf; ComponentLink1URL: \\cern.ch\dfs\Applications\Altium\Datasheets\LED_AVAGO_HSME-C110_DESIGN-GUIDE.pdf; ComponentLink1Description: Design Guide; Author: CERN DEM JMW; CreateDate: 2009-07-22; LatestRevisionDate: 2012-06-20
LDy = LED_SMD_90deg_mini_B: LED Blue Avago C120; Part Number: LED_AVAGO_HSMR-C120; Part Description: High Performance Right Angle Chip Blue LED; Manufacturer: AVAGO TECHNOLOGIES; Manufacturer Part Number: HSMR-C120; Table: LEDs & Displays; Component Kind: Standard; Component Type: Standard; Color: Blue; Footprint: LED_AVAGO_HSMR-C120; PackageDescription: Blue Chip LED, 2-Leads, Body 1.7x1.1mm, Side Emitting Package; Pin Count: 2; Mounted: Yes; Socket: No; SMD: Yes; ComponentHeight: 0.7mm; HelpURL: \\cern.ch\dfs\Applications\Altium\Datasheets\LED_AVAGO_HSME-C120.pdf; ComponentLink1URL: \\cern.ch\dfs\Applications\Altium\Datasheets\LED_AVAGO_HSME-C110_DESIGN-GUIDE.pdf; ComponentLink1Description: Design Guide; Author: CERN DEM JMW; CreateDate: 2009-07-22; LatestRevisionDate: 2012-06-20
LED17 = LED_0603R: LED 0603 red; Supplier 1: Newark; Supplier Part Number 1: 22M3004; Supplier 2: Newark; Supplier Part Number 2: 20M0618
R1 R7-R18 R27-R35 R56 R96 R148-R157 R335 = R0402_100R_1%_0.0625W_100PPM: Resistor - 1%; Part Description: General Purpose Thick Film Chip Resistor; Manufacturer: GENERIC; Manufacturer1 Part Number: 232270671001L; TC: ±100ppm/°C; Table: Resistors SMD; Part Number: R0402_100R_1%_0.0625W_100PPM; Component Kind: Standard; Component Type: Standard; Pin Count: 2; Value: 100; Status: Not recommended; Power: 0.0625W; Tolerance: ±1%; Manufacturer Part Number: R0402_100R_1%_0.0625W_100PPM; Case: 0402; Mounted: Yes; Socket: No; SMD: Yes; Manufacturer1 Example: YAGEO PHYCOMP; Manufacturer1 ComponentHeight: 0.4mm; HelpURL: \\cern.ch\dfs\Applications\Altium\Datasheets\R0402_Phycomp_RC0402.pdf; Author: CERN DEM JLC; CreateDate: 2007-12-03; LatestRevisionDate: 2012-10-17
R2-R6 R19 R97-R102 R123 R238 = R0402_10K_1%_0.0625W_100PPM: Resistor - 1%; Part Description: General Purpose Thick Film Chip Resistor; Manufacturer: GENERIC; Manufacturer1 Part Number: 232270671003L; TC: ±100ppm/°C; Table: Resistors SMD; Part Number: R0402_10K_1%_0.0625W_100PPM; Component Kind: Standard; Component Type: Standard; Pin Count: 2; Value: 10k; Status: Not recommended; Power: 0.0625W; Tolerance: ±1%; Manufacturer Part Number: R0402_10K_1%_0.0625W_100PPM; Case: 0402; Mounted: Yes; Socket: No; SMD: Yes; Manufacturer1 Example: YAGEO PHYCOMP; Manufacturer1 ComponentHeight: 0.4mm; HelpURL: \\cern.ch\dfs\Applications\Altium\Datasheets\R0402_Phycomp_RC0402.pdf; Author: CERN DEM JLC; CreateDate: 2007-12-03; LatestRevisionDate: 2012-10-17
R20-R22 = R0402_4K7_1%_0.0625W_100PPM: Resistor - 1%; Part Description: General Purpose Thick Film Chip Resistor; Manufacturer: GENERIC; Manufacturer1 Part Number: 232270674702L; TC: ±100ppm/°C; Table: Resistors SMD; Part Number: R0402_4K7_1%_0.0625W_100PPM; Component Kind: Standard; Component Type: Standard; Pin Count: 2; Value: 4k7; Status: Not recommended; Power: 0.0625W; Tolerance: ±1%; Manufacturer Part Number: R0402_4K7_1%_0.0625W_100PPM; Case: 0402; Mounted: Yes; Socket: No; SMD: Yes; Manufacturer1 Example: YAGEO PHYCOMP; Manufacturer1 ComponentHeight: 0.4mm; HelpURL: \\cern.ch\dfs\Applications\Altium\Datasheets\R0402_Phycomp_RC0402.pdf; Author: CERN DEM JLC; CreateDate: 2007-12-03; LatestRevisionDate: 2012-10-17
R23 R24 R175 = R0402_330R_1%_0.0625W_100PPM: Resistor - 1%; Part Description: General Purpose Thick Film Chip Resistor; Manufacturer: GENERIC; Manufacturer1 Part Number: 232270673301L; TC: ±100ppm/°C; Table: Resistors SMD; Part Number: R0402_330R_1%_0.0625W_100PPM; Component Kind: Standard; Component Type: Standard; Pin Count: 2; Value: 330; Status: Not recommended; Power: 0.0625W; Tolerance: ±1%; Manufacturer Part Number: R0402_330R_1%_0.0625W_100PPM; Case: 0402; Mounted: Yes; Socket: No; SMD: Yes; Manufacturer1 Example: YAGEO PHYCOMP; Manufacturer1 ComponentHeight: 0.4mm; HelpURL: \\cern.ch\dfs\Applications\Altium\Datasheets\R0402_Phycomp_RC0402.pdf; Author: CERN DEM JLC; CreateDate: 2007-12-03; LatestRevisionDate: 2012-10-17
R47 R169-R174 R176 = R0402_2K2_1%_0.0625W_100PPM: as R36 on sheet IPMI; Part Number: R0402_2K2_1%_0.0625W_100PPM; Component Kind: Standard; Component Type: Standard; Pin Count: 2; Value: 2k2; Status: Not recommended; Power: 0.0625W; Tolerance: ±1%; Manufacturer Part Number: R0402_2K2_1%_0.0625W_100PPM; Case: 0402; Mounted: Yes; Socket: No; SMD: Yes; Manufacturer1 Example: YAGEO PHYCOMP; Manufacturer1 ComponentHeight: 0.4mm; HelpURL: \\cern.ch\dfs\Applications\Altium\Datasheets\R0402_Phycomp_RC0402.pdf; Author: CERN DEM JLC; CreateDate: 2007-12-03; LatestRevisionDate: 2012-10-17
TP1 TP2 TP10 = TP: Testpoint
X1 X2 = X_CRYSTAL_SMD_5.0*3.2: miniature crystal oscillator (Maritex) QSDG8M000-TXC

## Sheet Thermometers.SchDoc
size A4; DocumentNumber: 12; SheetNumber: 12; SheetTotal: 30
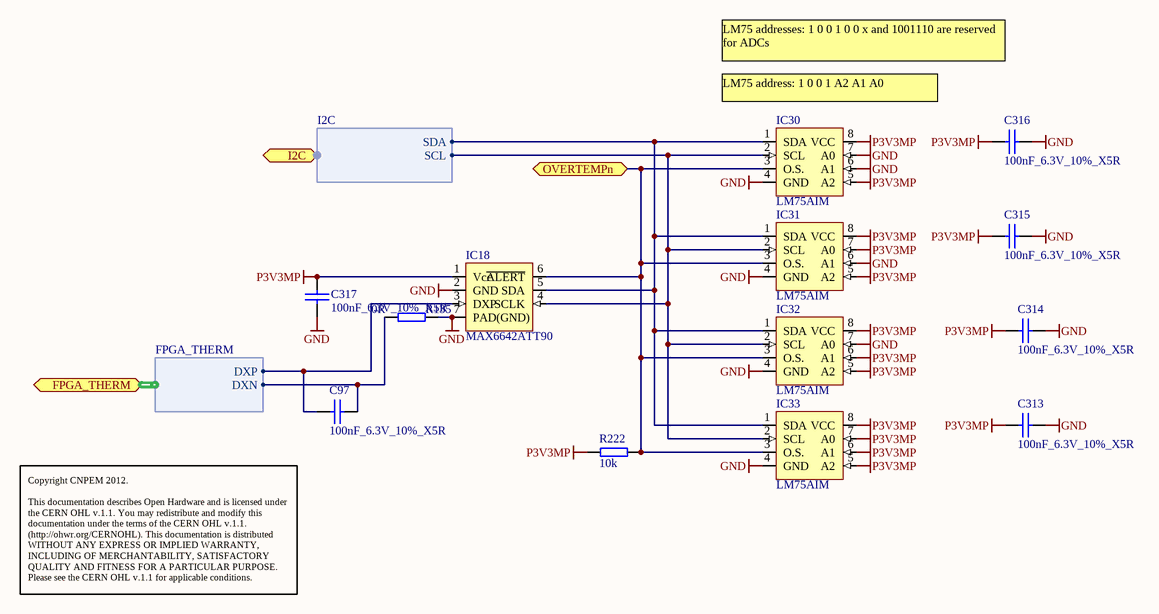
[diagram p22: Thermometers.SchDoc]

### Parts
C97  100nF_6.3V_10%_X5R  [0201C]
C313  100nF_6.3V_10%_X5R  [0201C]
C314  100nF_6.3V_10%_X5R  [0201C]
C315  100nF_6.3V_10%_X5R  [0201C]
C316  100nF_6.3V_10%_X5R  [0201C]
C317  100nF_6.3V_10%_X5R  [0201C]
IC18  MAX6642ATT90  [TFDN6]
IC30  LM75AIM  [SOIC127P600X175-8N]
IC31  LM75AIM  [SOIC127P600X175-8N]
IC32  LM75AIM  [SOIC127P600X175-8N]
IC33  LM75AIM  [SOIC127P600X175-8N]
R135  0R  [0402R]
R222  10k  [0402R]

### Ports
FPGA_THERM (harness FPGA_THERM), I2C (harness I2C), OVERTEMPn (bidir)

### Harnesses
FPGA_THERM: DXN, DXP
I2C: SCL, SDA

### Nets
GND: C313.2 C314.2 C315.2 C316.2 C317.2 IC18.2(GND) IC18.7(PAD(GND)) IC30.4(GND) IC30.6(A1) IC30.7(A0) IC31.4(GND) IC31.6(A1) IC32.4(GND) IC32.7(A0) IC33.4(GND) R135.2
P3V3MP: C313.1 C314.1 C315.1 C316.1 C317.1 IC18.1(Vcc) IC30.5(A2) IC30.8(VCC) IC31.5(A2) IC31.7(A0) IC31.8(VCC) IC32.5(A2) IC32.6(A1) IC32.8(VCC) IC33.5(A2) IC33.6(A1) IC33.7(A0) IC33.8(VCC) R222.1
FPGA_ALERTn: IC18.6(~{ALERT}) IC30.3(O.S.) IC31.3(O.S.) IC32.3(O.S.) IC33.3(O.S.) R222.2 ; port OVERTEMPn
FTMP.DXN: C97.2 R135.1 ; port FPGA_THERM.DXN
FTMP.DXP: C97.1 IC18.3(DXP) ; port FPGA_THERM.DXP
I2C_CPU.SCL: IC18.4(SCLK) IC30.2(SCL) IC31.2(SCL) IC32.2(SCL) IC33.2(SCL) ; port I2C.SCL
I2C_CPU.SDA: IC18.5(SDA) IC30.1(SDA) IC31.1(SDA) IC32.1(SDA) IC33.1(SDA) ; port I2C.SDA

### Notes on the sheet
- (near IC30) LM75 address: 1 0 0 1 A2 A1 A0
- LM75 addresses: 1 0 0 1 0 0 x and 1001110 are reserved for ADCs
- Copyright CNPEM 2012.
  This documentation describes Open Hardware and is licensed under the CERN OHL v.1.1. You may redistribute and modify this documentation under the terms of the CERN OHL v.1.1. (http://ohwr.org/CERNOHL). This documentation is distributed WITHOUT ANY EXPRESS OR IMPLIED WARRANTY, INCLUDING OF MERCHANTABILITY, SATISFACTORY QUALITY AND FITNESS FOR A PARTICULAR PURPOSE. Please see the CERN OHL v.1.1 for applicable conditions.

### Library data of the parts
C97 C313-C317 = CAP_SMD_0201: Capacitor SMD
IC18 = SENS_MAX6642: ±1°C, SMBus- Remote/Local Temperature Sensor with Overtemperature Alarm; Supplier 1: Digi-Key; Supplier Part Number 1: MAX6642ATT90+TCT-ND
IC30-IC33 = SENS_LM75: I2C temperature sensor
R135 = RES_0402: SMD Resistor; Supplier 1: Newark; Supplier Part Number 1: 59M6691
R222 = RES_SMD: SMD Resistor

## Sheet USB_UART.SchDoc
size A4; DocumentNumber: 29; SheetNumber: 29; SheetTotal: 30
Used 2 times, as channels IPMI/UUART, UUART. Parts and nets are listed once, with the designators drawn on the sheet.
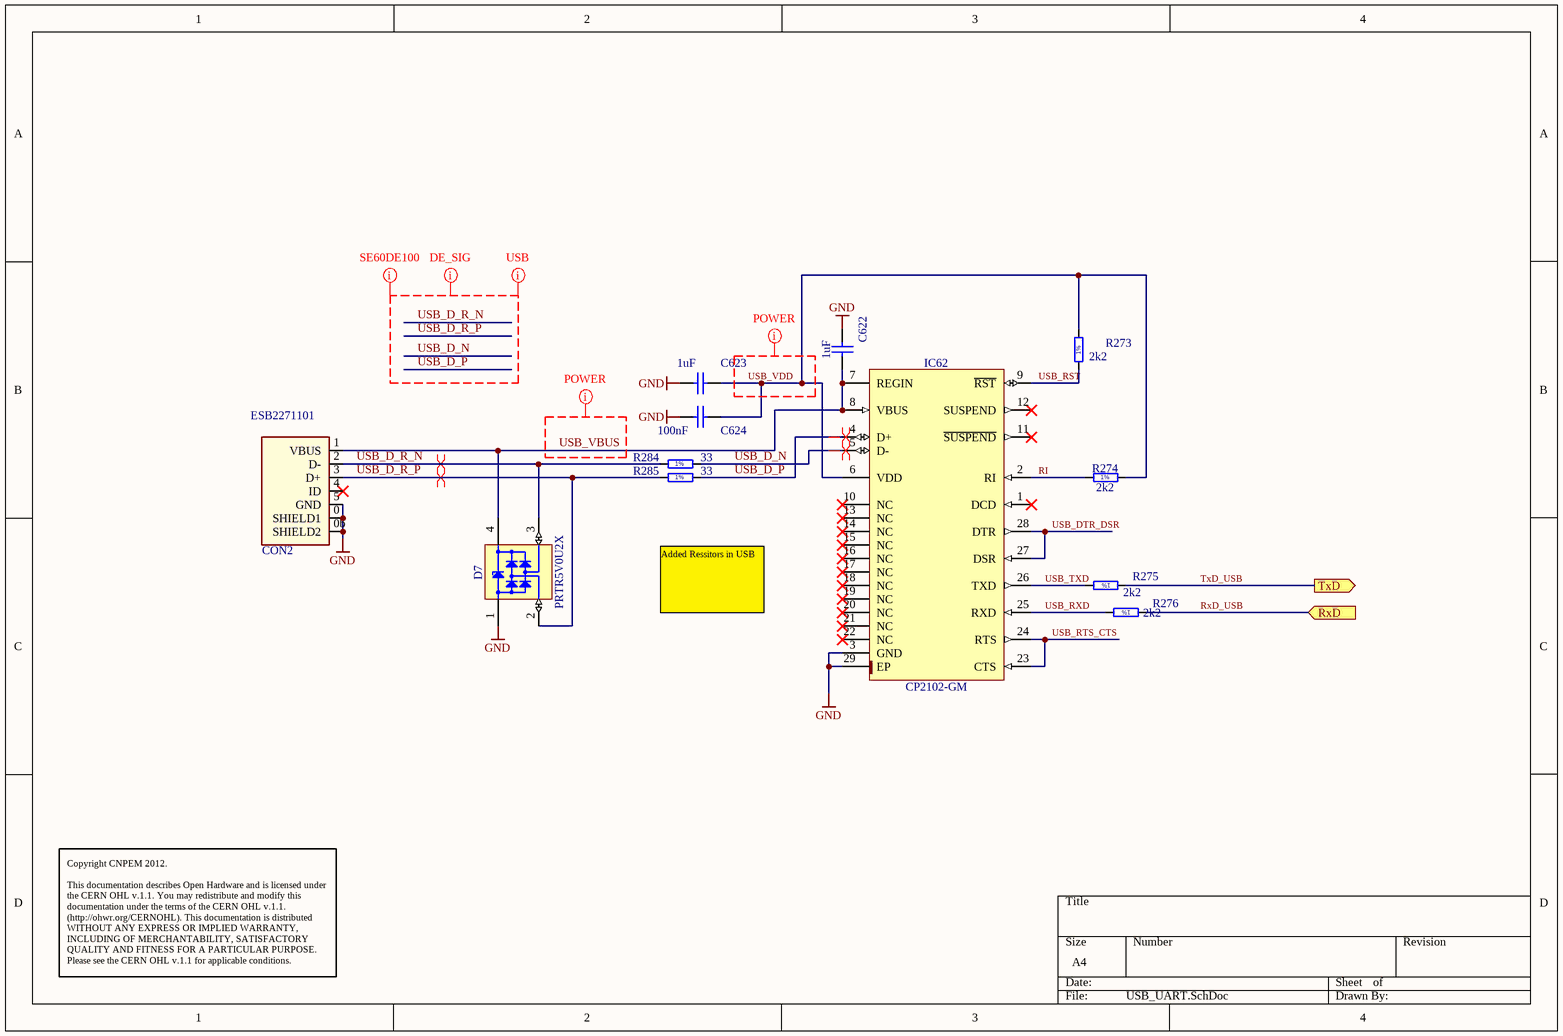
[diagram p23: USB_UART.SchDoc]

### Parts
C622  1uF  [CAPC1608X87N]
C623  1uF  [CAPC1608X87N]
C624  100nF  [CAPC0603X33N]
CON2  ESB2271101  [USB_MICRO_ESB2271101]
D7  PRTR5V0U2X  [SOT190P230X110-4N]
IC62  CP2102-GM  [QFN50P500X500X100-29N-S335]
R273  2k2  [RESC1005X40N]
R274  2k2  [RESC1005X40N]
R275  2k2  [RESC1005X40N]
R276  2k2  [RESC1005X40N]
R284  33  [RESC1005X40N]
R285  33  [RESC1005X40N]

### Ports
RxD (in), TxD (out)

### Nets
GND: C622.1 C623.1 C624.1 CON2.0(SHIELD1) CON2.0a(SHIELD1) CON2.0b(SHIELD2) CON2.0c(SHIELD2) CON2.5(GND) D7.1(GND) IC62.3(GND) IC62.29(EP)
RI: IC62.2(RI) R274.1
RxD_USB: R276.1 ; port RxD
TxD_USB: R275.1 ; port TxD
USB_D_N: IC62.5(D-) R284.2
USB_D_P: IC62.4(D+) R285.2
USB_D_R_N: CON2.2(D-) D7.3(I/O2) R284.1
USB_D_R_P: CON2.3(D+) D7.2(I/O1) R285.1
USB_DTR_DSR: IC62.27(DSR) IC62.28(DTR)
USB_RST: IC62.9(~{RST}) R273.1
USB_RTS_CTS: IC62.23(CTS) IC62.24(RTS)
USB_RXD: IC62.25(RXD) R276.2
USB_TXD: IC62.26(TXD) R275.2
USB_VBUS: C622.2 CON2.1(VBUS) D7.4(VCC) IC62.7(REGIN) IC62.8(VBUS)
USB_VDD: C623.2 C624.2 IC62.6(VDD) R273.2 R274.2

Not connected (* = marked no-connect by the designer): CON2 4(ID)*; IC62 1(DCD)* 10(NC)* 11(~{SUSPEND})* 12(SUSPEND)* 13(NC)* 14(NC)* 15(NC)* 16(NC)* 17(NC)* 18(NC)* 19(NC)* 20(NC)* 21(NC)* 22(NC)*

### Channels
IPMI/UUART: designators end in A; ports RxD=CONSOLE_TXD TxD=CONSOLE_RXD
UUART: designators end in B; ports RxD=RxD_USB TxD=TxD_USB

### Layout directives
differential pair: USB_D_N_UUART, USB_D_P_UUART, USB_D_R_N_UUART, USB_D_R_P_UUART
net class POWER: USB_VBUS, USB_VDD
net class SE60DE100: USB_D_N, USB_D_P, USB_D_R_N, USB_D_R_P
net class DE_SIG: USB_D_N, USB_D_P, USB_D_R_N, USB_D_R_P
net class USB: USB_D_N, USB_D_P, USB_D_R_N, USB_D_R_P

### Notes on the sheet
- Added Ressitors in USB
- Copyright CNPEM 2012.
  This documentation describes Open Hardware and is licensed under the CERN OHL v.1.1. You may redistribute and modify this documentation under the terms of the CERN OHL v.1.1. (http://ohwr.org/CERNOHL). This documentation is distributed WITHOUT ANY EXPRESS OR IMPLIED WARRANTY, INCLUDING OF MERCHANTABILITY, SATISFACTORY QUALITY AND FITNESS FOR A PARTICULAR PURPOSE. Please see the CERN OHL v.1.1 for applicable conditions.
- (in symbol R0402_2K2_1%_0.0625W_100PPM) 1%
- (in symbol R0402_33R_1%_0.0625W_100PPM) 1%

### Library data of the parts
C622 C623 = CC0603_1UF_16V_10%_X7R: Non-polarised capacitor; Part Description: SMD Multilayer Chip Ceramic Capacitor; Manufacturer: GENERIC; Manufacturer1 Part Number: 223824613663; Voltage: 16V; TC: X7R; Tolerance: ±10%; Table: Capacitors SMD; Part Number: CC0603_1UF_16V_10%_X7R; Component Kind: Standard; Component Type: Standard; Pin Count: 2; Value: 1uF; Status: Preferred; Manufacturer Part Number: CC0603_1uF_16V_10%_X7R; Case: 0603; Mounted: Yes; Socket: No; SMD: Yes; Manufacturer1 Example: PHYCOMP; Manufacturer1 ComponentHeight: 0.87mm; HelpURL: \\cern.ch\dfs\Applications\Altium\Datasheets\CC0805_X5R_PHYCOMP_HC.pdf; Author: CERN DEM JLC; CreateDate: 2007-12-03; LatestRevisionDate: 2007-12-03
C624 = CC0201_100NF_6.3V_10%_X5R: as C776 on sheet IPMI; Part Number: CC0201_100NF_6.3V_10%_X5R; Component Kind: Standard; Component Type: Standard; Pin Count: 2; Value: 100nF; Status: Not Recommended; Manufacturer Part Number: CC0201_100NF_6.3V_10%_X5R; Case: 0201; Mounted: Yes; Socket: No; SMD: Yes; Manufacturer1 Example: AVX; Manufacturer1 ComponentHeight: 0.33mm; HelpURL: \\cern.ch\dfs\Applications\Altium\Datasheets\CC0201_X5R_AVX.pdf; Author: CERN DEM JLC; CreateDate: 2007-12-03; LatestRevisionDate: 2007-12-03
CON2 = CON_USB_AB_MICRO: USB micro AB connector; Part Number: 10133; Device: USB_Mini_AB
D7 = PRTR5V0U2X: Ultra Low Capacitance Double Rail-to-Rail ESD Protection Diode; Part Description: Ultra Low Capacitance (1pF) Double Rail-to-Rail ESD Protection Diode (8kV); Manufacturer: NXP SEMICONDUCTORS; Voltage: 5.5V; Table: Diodes; Part Number: PRTR5V0U2X; Component Kind: Standard; Component Type: Standard; Device: PRTR5V0U2X; PackageDescription: SOT143B, SOT, 1.90mm Pitch; 4 Pin, 1.30mm W X 2.90mm L X 1.10mm H body, IPC Medium Density; Manufacturer Part Number: PRTR5V0U2X; Pin Count: 4; Case: SOT143B; Mounted: Yes; Socket: No; SMD: Yes; ComponentHeight: 1.1mm; HelpURL: \\cern.ch\dfs\Applications\Altium\Datasheets\PRTR5V0U2X.pdf; Author: CERN DEM JLC; CreateDate: 2011-03-22; LatestRevisionDate: 2011-03-22
IC62 = CP2102-GM: Single-Chip USB to UART Bridge; Manufacturer: SILICON LABS; Table: Analog & Interface; Part Number: CP2102-GM; Component Kind: Standard; Component Type: Standard; Device: CP2102-GM; PackageDescription: QFN, 0.50mm Pitch, Square; 28 pin, 5.00mm L X 5.00mm W X 1.00mm H body (w/thermal tab 3.35 X 3.35mm),  IPC Medium Density; Part Description: Single-Chip USB to UART Bridge; Manufacturer Part Number: CP2102-GM; Pin Count: 29; Case: QFN28; Mounted: Yes; Socket: No; SMD: Yes; ComponentHeight: 1.0mm; Author: CERN DEM JLC; HelpURL: \\cern.ch\dfs\Applications\Altium\Datasheets\CP2102-GM.pdf; CreateDate: 3/3/2011; LatestRevisionDate: 3/3/2011
R273-R276 = R0402_2K2_1%_0.0625W_100PPM: as R36 on sheet IPMI; Part Number: R0402_2K2_1%_0.0625W_100PPM; Component Kind: Standard; Component Type: Standard; Pin Count: 2; Value: 2k2; Status: Not recommended; Power: 0.0625W; Tolerance: ±1%; Manufacturer Part Number: R0402_2K2_1%_0.0625W_100PPM; Case: 0402; Mounted: Yes; Socket: No; SMD: Yes; Manufacturer1 Example: YAGEO PHYCOMP; Manufacturer1 ComponentHeight: 0.4mm; HelpURL: \\cern.ch\dfs\Applications\Altium\Datasheets\R0402_Phycomp_RC0402.pdf; Author: CERN DEM JLC; CreateDate: 2007-12-03; LatestRevisionDate: 2012-10-17
R284 R285 = R0402_33R_1%_0.0625W_100PPM: Resistor - 1%; Part Description: General Purpose Thick Film Chip Resistor; Manufacturer: GENERIC; Manufacturer1 Part Number: 232270673309L; TC: ±100ppm/°C; Table: Resistors SMD; Part Number: R0402_33R_1%_0.0625W_100PPM; Component Kind: Standard; Component Type: Standard; Pin Count: 2; Value: 33; Status: Not recommended; Power: 0.0625W; Tolerance: ±1%; Manufacturer Part Number: R0402_33R_1%_0.0625W_100PPM; Case: 0402; Mounted: Yes; Socket: No; SMD: Yes; Manufacturer1 Example: YAGEO PHYCOMP; Manufacturer1 ComponentHeight: 0.4mm; HelpURL: \\cern.ch\dfs\Applications\Altium\Datasheets\R0402_Phycomp_RC0402.pdf; Author: CERN DEM JLC; CreateDate: 2007-12-03; LatestRevisionDate: 2012-10-17

## Sheet RTCE.SchDoc
size A4; DocumentNumber: 30; SheetNumber: 30; SheetTotal: 30
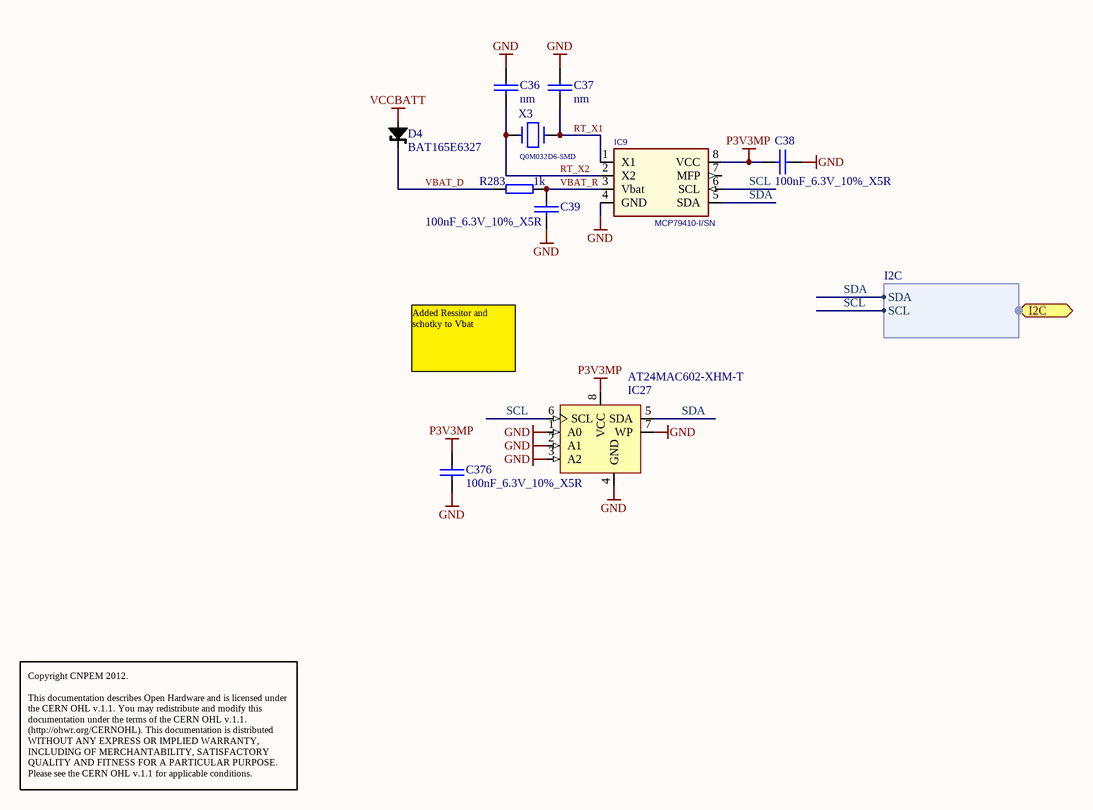
[diagram p24: RTCE.SchDoc]

### Parts
C36  nm  [0402C]
C37  nm  [0402C]
C38  100nF_6.3V_10%_X5R  [0201C]
C39  100nF_6.3V_10%_X5R  [0201C]
C376  100nF_6.3V_10%_X5R  [0201C]
D4  BAT165E6327  [SOD323]
IC9  MCP79410-I/SN  [SO-8]
IC27  AT24MAC602-XHM-T  [TSSOP-8]
R283  1k  [0402R]
X3  Q0M032D6-SMD  [crystal_85SMX]

### Ports
I2C (harness I2C)

### Harnesses
I2C: SCL, SDA

### Nets
GND: C36.1 C37.1 C38.2 C39.2 C376.2 IC9.4(GND) IC27.1(A0) IC27.2(A1) IC27.3(A2) IC27.4(GND) IC27.7(WP)
P3V3MP: C38.1 C376.1 IC9.8(VCC) IC27.8(VCC)
VCCBATT: D4.A
RT_X1: C37.2 IC9.1(X1) X3.1
RT_X2: C36.2 IC9.2(X2) X3.4
SCL: IC9.6(SCL) IC27.6(SCL) ; port I2C.SCL  [project net I2C_CPU.SCL]
SDA: IC9.5(SDA) IC27.5(SDA) ; port I2C.SDA  [project net I2C_CPU.SDA]
VBAT_D: D4.K R283.1
VBAT_R: C39.1 IC9.3(Vbat) R283.2

Not connected (* = marked no-connect by the designer): IC9 7(MFP)

### Notes on the sheet
- Added Ressitor and schotky to Vbat
- Copyright CNPEM 2012.
  This documentation describes Open Hardware and is licensed under the CERN OHL v.1.1. You may redistribute and modify this documentation under the terms of the CERN OHL v.1.1. (http://ohwr.org/CERNOHL). This documentation is distributed WITHOUT ANY EXPRESS OR IMPLIED WARRANTY, INCLUDING OF MERCHANTABILITY, SATISFACTORY QUALITY AND FITNESS FOR A PARTICULAR PURPOSE. Please see the CERN OHL v.1.1 for applicable conditions.

### Library data of the parts
C36 C37 = CAP_SMD_0402: Capacitor SMD; Supplier 1: Newark; Supplier Part Number 1: 14T3275
C38 C39 C376 = CAP_SMD_0201: Capacitor SMD
D4 = D_BAT165: 500mA, 40V, Shottky Diode
IC9 = RTC_MCP79410: RTC with 1k EEPROM and RAM; Supplier 1: Newark; Supplier Part Number 1: 76R6660
IC27 = MEM_24MAC602: Serial 2K EEPROM+ 48bit MAC
R283 = RES_0402: SMD Resistor; Supplier 1: Newark; Supplier Part Number 1: 59M6691
X3 = X_CRYSTAL_32k_SMD: Crystal oscillator 32k (Maritex); Supplier 1: Farnell; Supplier Part Number 1: 1832136